# EAGLE design Dice_Simulator (EAGLE 9.6.2)
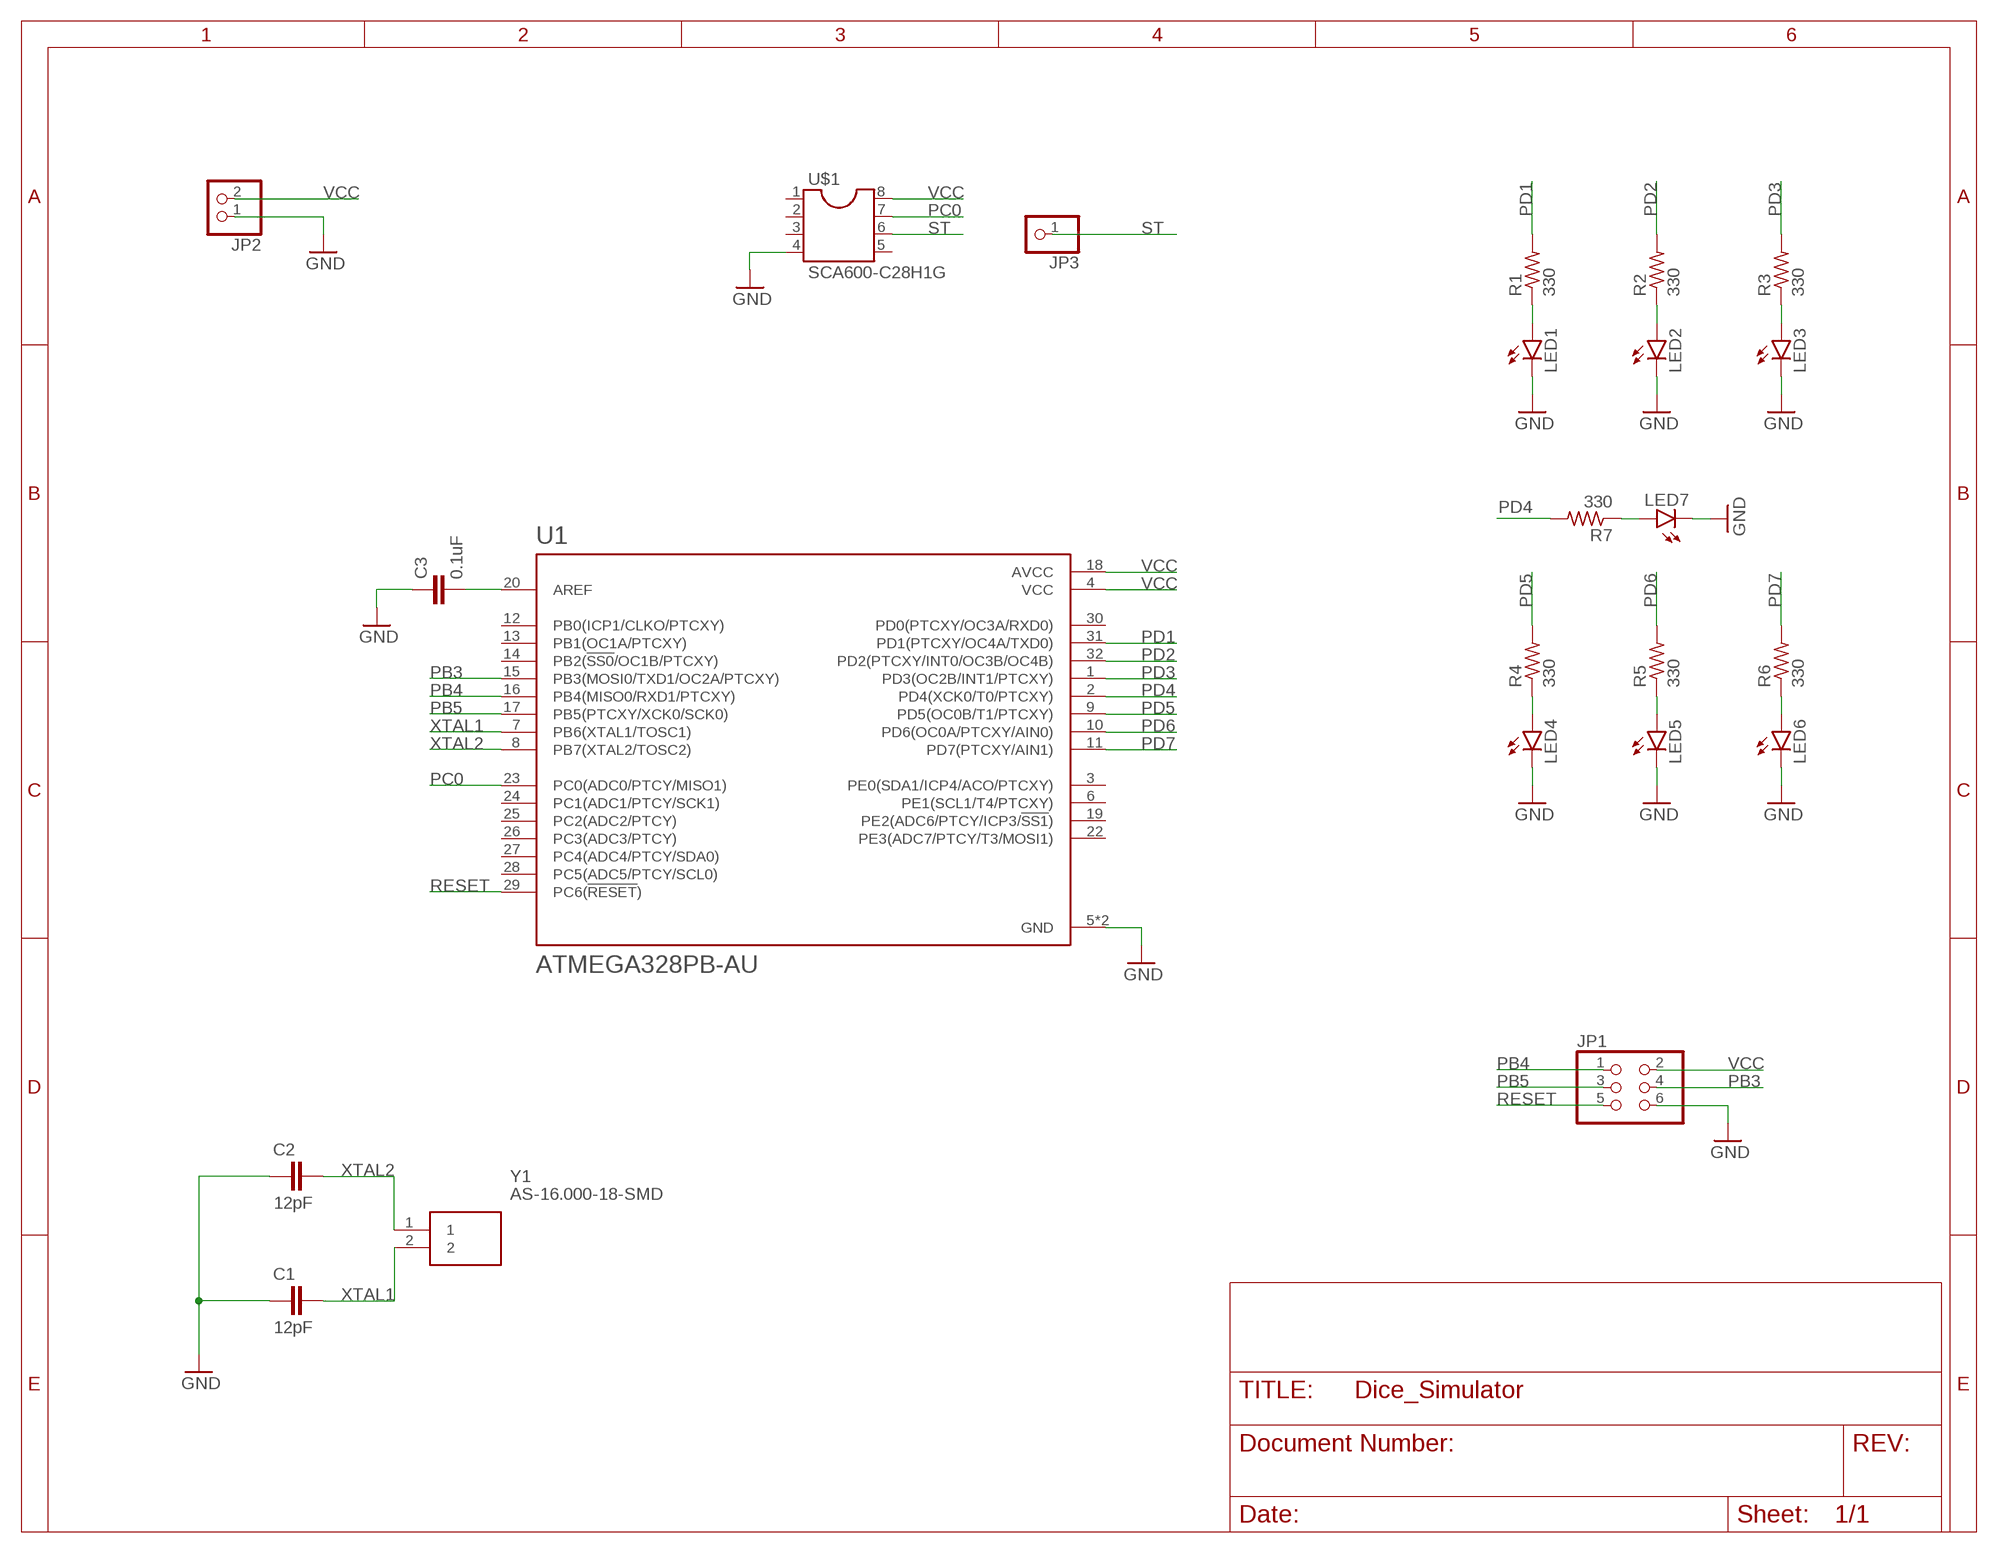
[diagram p0: schematic, sheet 1]

## Parts
C1  12pF  C-EUC0805  [C0805]
C2  12pF  C-EUC0805  [C0805]
C3  0.1uF  C-EUC0805  [C0805]
JP1  PINHD-2X3  [2X03]
JP2  PINHD-1X2  [1X02]
JP3  PINHD-1X1  [1X01]
LED1  LEDCHIPLED_0805  [CHIPLED_0805]
LED2  LEDCHIPLED_0805  [CHIPLED_0805]
LED3  LEDCHIPLED_0805  [CHIPLED_0805]
LED4  LEDCHIPLED_0805  [CHIPLED_0805]
LED5  LEDCHIPLED_0805  [CHIPLED_0805]
LED6  LEDCHIPLED_0805  [CHIPLED_0805]
LED7  LEDCHIPLED_0805  [CHIPLED_0805]
R1  330  R-US_M0805  [M0805]
R2  330  R-US_M0805  [M0805]
R3  330  R-US_M0805  [M0805]
R4  330  R-US_M0805  [M0805]
R5  330  R-US_M0805  [M0805]
R6  330  R-US_M0805  [M0805]
R7  330  R-US_M0805  [M0805]
U1  ATMEGA328PB-AU  [QFP80P900X900X120-32N]
U$1  SCA600-C28H1G  [SCA600-C28H1G]
Y1  AS-16.000-18-SMD  [HC-49]

## Nets
GND: C1.1 C2.1 C3.1 JP1.6 JP2.1 LED1.C LED2.C LED3.C LED4.C LED5.C LED6.C LED7.C U1.5(GND) U1.21(GND) U$1.4
N$1: LED1.A R1.1
N$2: LED2.A R2.1
N$3: LED3.A R3.1
N$4: LED4.A R4.1
N$5: LED5.A R5.1
N$6: LED6.A R6.1
N$7: LED7.A R7.1
N$8: C3.2 U1.20(AREF)
PB3: JP1.4 U1.15(PB3(MOSI0/TXD1/OC2A/PTCXY))
PB4: JP1.1 U1.16(PB4(MISO0/RXD1/PTCXY))
PB5: JP1.3 U1.17(PB5(PTCXY/XCK0/SCK0))
PC0: U1.23(PC0(ADC0/PTCY/MISO1)) U$1.7
PD1: R1.2 U1.31(PD1(PTCXY/OC4A/TXD0))
PD2: R2.2 U1.32(PD2(PTCXY/INT0/OC3B/OC4B))
PD3: R3.2 U1.1(PD3(OC2B/INT1/PTCXY))
PD4: R7.2 U1.2(PD4(XCK0/T0/PTCXY))
PD5: R4.2 U1.9(PD5(OC0B/T1/PTCXY))
PD6: R5.2 U1.10(PD6(OC0A/PTCXY/AIN0))
PD7: R6.2 U1.11(PD7(PTCXY/AIN1))
RESET: JP1.5 U1.29(PC6(!RESET!))
ST: JP3.1 U$1.6
VCC: JP1.2 JP2.2 U1.4(VCC) U1.18(AVCC) U$1.8
XTAL1: C1.2 U1.7(PB6(XTAL1/TOSC1)) Y1.2
XTAL2: C2.2 U1.8(PB7(XTAL2/TOSC2)) Y1.1
Unconnected: U1.3(PE0(SDA1/ICP4/ACO/PTCXY)) U1.6(PE1(SCL1/T4/PTCXY)) U1.12(PB0(ICP1/CLKO/PTCXY)) U1.13(PB1(OC1A/PTCXY)) U1.14(PB2(!SS0!/OC1B/PTCXY)) U1.19(PE2(ADC6/PTCY/ICP3/!SS1!)) U1.22(PE3(ADC7/PTCY/T3/MOSI1)) U1.24(PC1(ADC1/PTCY/SCK1)) U1.25(PC2(ADC2/PTCY)) U1.26(PC3(ADC3/PTCY)) U1.27(PC4(ADC4/PTCY/SDA0)) U1.28(PC5(ADC5/PTCY/SCL0)) U1.30(PD0(PTCXY/OC3A/RXD0)) U$1.1 U$1.2 U$1.3 U$1.5

## Library data of the parts
C1-C3 = rcl:C-EU: CAPACITOR, European symbol; SPICEPREFIX: C
JP1 = pinhead:PINHD-2X3: PIN HEADER
JP2 = pinhead:PINHD-1X2: PIN HEADER
JP3 = pinhead:PINHD-1X1: PIN HEADER
LED1-LED7 = led:LED: LED OSRAM: - CHIPLED LG R971, LG N971, LY N971, LG Q971, LY Q971, LO R971, LY R971 LH N974, LH R974 LS Q976, LO Q976, LY Q976 LO Q996 - Hyper CHIPLED LW Q18S LB Q993, LB Q99A, LB R99A - SideLED LS A670, LO A670, LY A670, LG A670, LP A670 LB A673, LV A673, LT A673, LW A673 LH A674 LY A675 LS A676, LA A676, LO A676, LY A676, LW A676 LS A679, LY A679, LG A679 - Hyper Micro SIDELED® LS Y876, LA Y876, LO Y876, LY Y876 LT Y87S - SmartLED LW L88C, LW L88S LB L89C, LB L89S, LG L890 LS L89K, LO L89K, LY L89K LS L896, LA L896, LO L896, LY L896 - TOPLED LS T670, LO T670, LY T670, LG T670, LP T670 LSG T670, LSP T670, LSY T670, LOP T670, LYG T670 LG T671, LOG T671, LSG T671 LB T673, LV T673, LT T673, LW T673 LH T674 LS T676, LA T676, LO T676, LY T676, LB T676, LH T676, LSB T676, LW T676 LB T67C, LV T67C, LT T67C, LS T67K, LO T67K, LY T67K, LW E67C LS E67B, LA E67B, LO E67B, LY E67B, LB E67C, LV E67C, LT E67C LW T67C LS T679, LY T679, LG T679 LS T770, LO T770, LY T770, LG T770, LP T770 LB T773, LV T773, LT T773, LW T773 LH T774 LS E675, LA E675, LY E675, LS T675 LS T776, LA T776, LO T776, LY T776, LB T776 LHGB T686 LT T68C, LB T68C - Hyper Mini TOPLED® LB M676 - Mini TOPLED Santana® LG M470 LS M47K, LO M47K, LY M47K Source: http://www.osram.convergy.de LUXEON: - LUMILED® LXK2-PW12-R00, LXK2-PW12-S00, LXK2-PW14-U00, LXK2-PW14-V00 LXK2-PM12-R00, LXK2-PM12-S00, LXK2-PM14-U00 LXK2-PE12-Q00, LXK2-PE12-R00, LXK2-PE12-S00, LXK2-PE14-T00, LXK2-PE14-U00 LXK2-PB12-K00, LXK2-PB12-L00, LXK2-PB12-M00, LXK2-PB14-N00, LXK2-PB14-P00, LXK2-PB14-Q00 LXK2-PR12-L00, LXK2-PR12-M00, LXK2-PR14-Q00, LXK2-PR14-R00 LXK2-PD12-Q00, LXK2-PD12-R00, LXK2-PD12-S00 LXK2-PH12-R00, LXK2-PH12-S00 LXK2-PL12-P00, LXK2-PL12-Q00, LXK2-PL12-R00 Source: www.luxeon.com KINGBRIGHT: KA-3528ASYC Source: www.kingbright.com
R1-R7 = rcl:R-US_: RESISTOR, American symbol; SPICEPREFIX: R
U1 = ATMEGA328PB-AU:ATMEGA328PB-AU: ATmega Series 20 MHz 32 KB Flash 2 KB SRAM 8-Bit Microcontroller - TQFP-32 Check prices <https://pricing.snapeda.com/parts/ATMEGA328PB-AU/Microchip%20Technology%20/%20Atmel/view-part?ref=eda>; AVAILABILITY: Good; DESCRIPTION: 8-bit Microcontrollers - MCU ATMEGA328PB 20MHZ IND TEMP; MF: Microchip Technology / Atmel; MP: ATMEGA328PB-AU; PACKAGE: TQFP-32 Microchip Technology / Atmel; PRICE: None; PURCHASE-URL: https://pricing.snapeda.com/search/part/ATMEGA328PB-AU/?ref=eda
U$1 = SCA600-C28H1G:SCA600-C28H1G
Y1 = SamacSys_Parts:AS-16.000-18-SMD: Crystal SMD 16.000MHz HC49S-SMD Crystal 16MHz, +/-30ppm, 2-Pin HC-49-US SMD Source: Datasheet <http://uk.rs-online.com/web/p/products/7037129P>; ALLIED_NUMBER: 70417567; DESCRIPTION: Crystal SMD 16.000MHz HC49S-SMD Crystal 16MHz, +/-30ppm, 2-Pin HC-49-US SMD; HEIGHT: mm; MANUFACTURER_NAME: RALTRON; MANUFACTURER_PART_NUMBER: AS-16.000-18-SMD; RS_PART_NUMBER: 7037129P; RS_PRICE-STOCK: http://uk.rs-online.com/web/p/products/7037129P

## Board
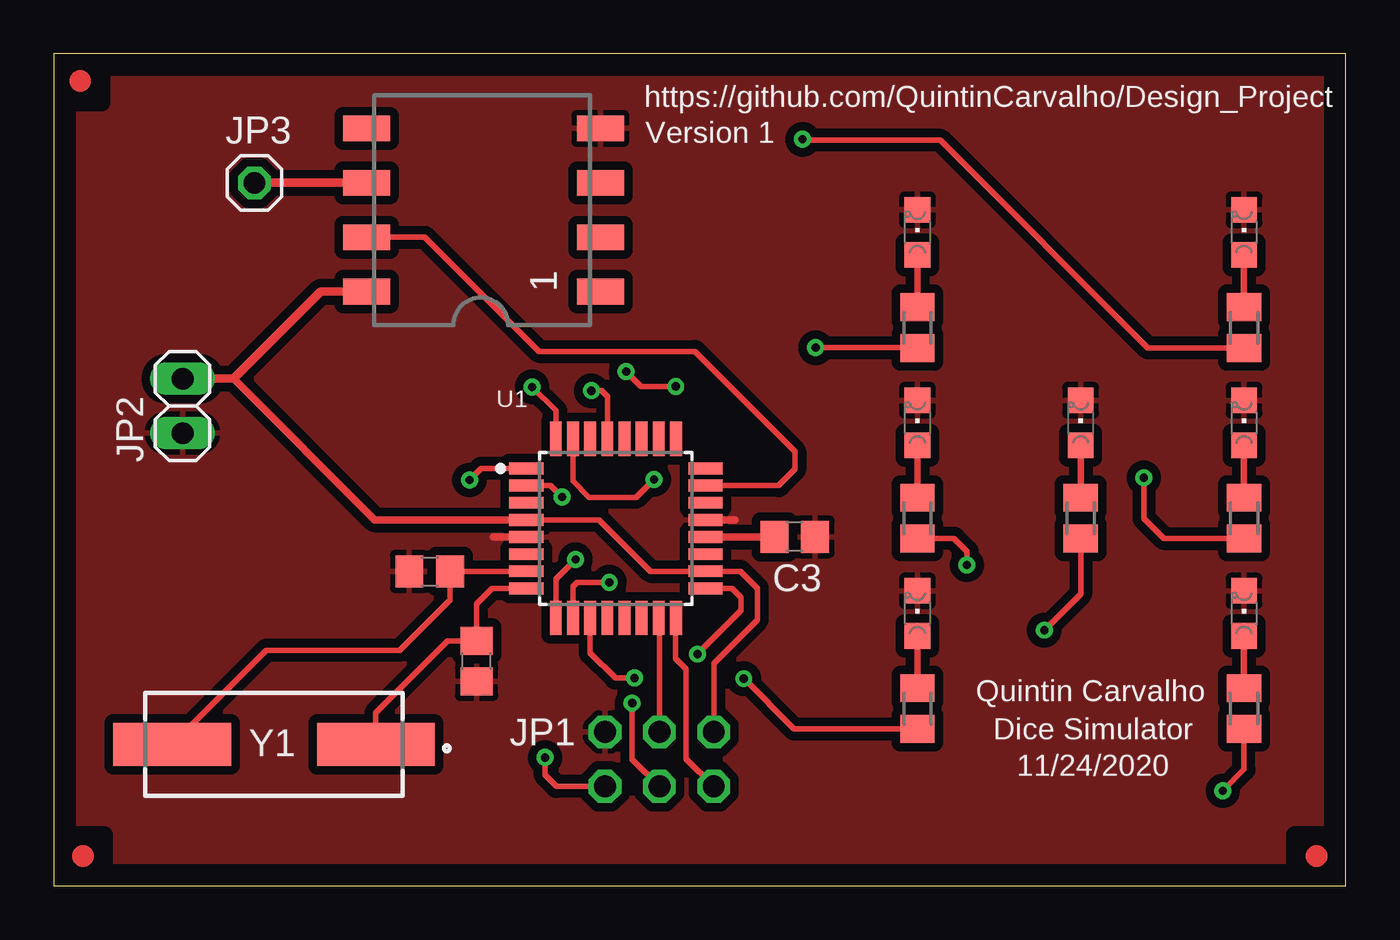
[diagram p1: board, top side]
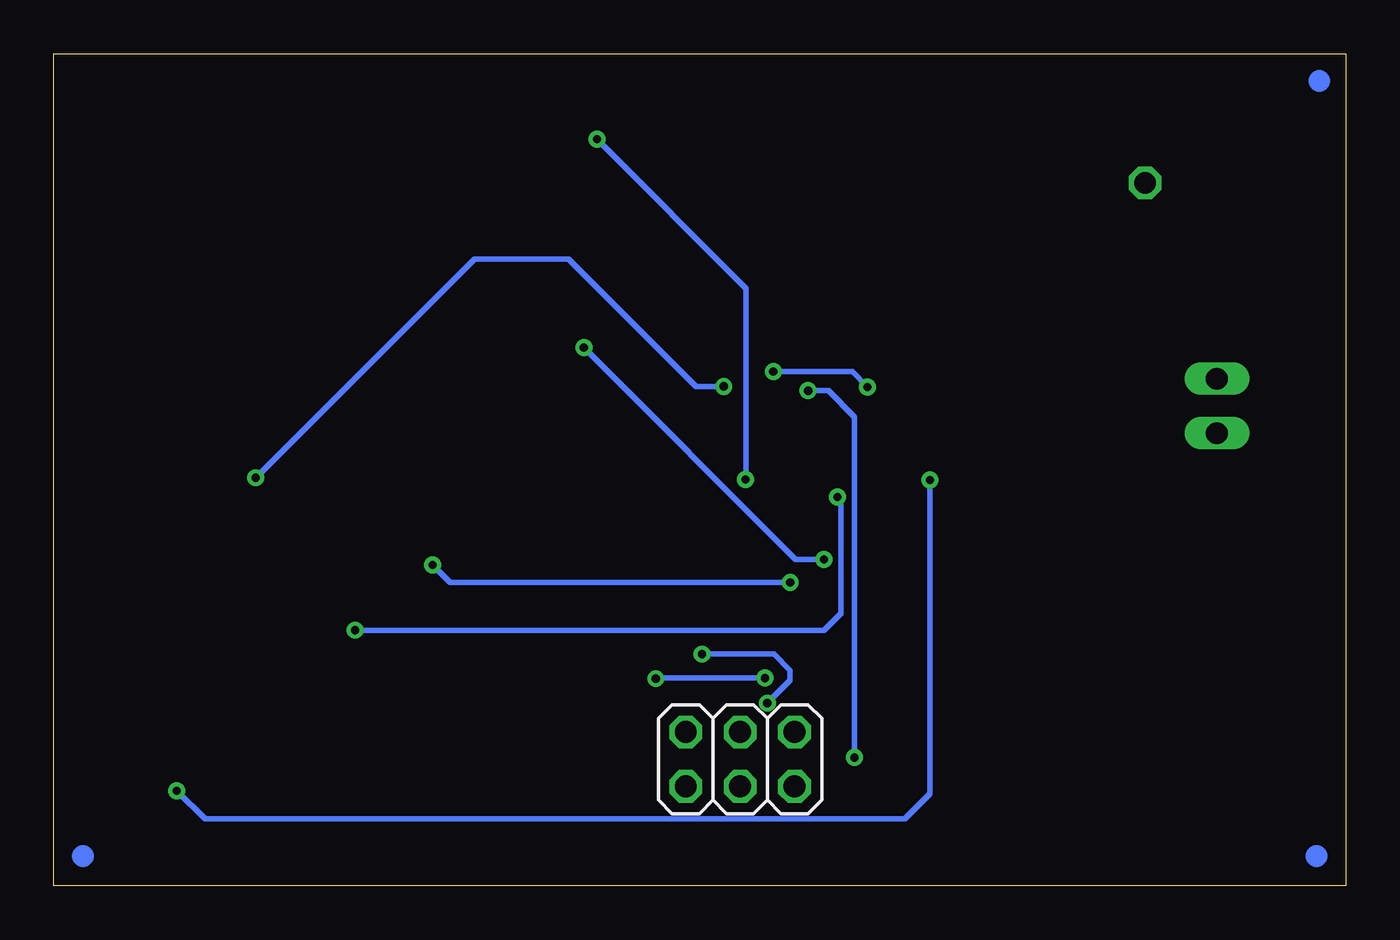
[diagram p2: board, bottom side, seen from below]

Size 60.3 x 38.85 mm. Coordinates in mm from the lower left corner, seen from the top.
Outline: 0,0 60.3,0 60.3,38.85 0,38.85 0,0
Copper layers (1*16): Top 0.035mm / dielectric 1.5mm / Bottom 0.035mm
Design rules "Design_Project": minimum track width 6mil, minimum drill 0.35mm, track to track 6mil, track to pad 6mil, pad to pad 6mil, via to via 6mil, smd to smd 6mil, copper to edge 40mil, drill to drill 6mil, minimum pad ring 10mil, minimum via ring 8mil, stop-mask expansion 4mil, vias tented up to drill 0mil, thermal gap 10mil

### Footprints (pad centres in the part's own frame; a part is rotated, then mirrored left to right if it is on the bottom)
C0805 = smd 1.3 x 1.5: 1 -0.95,0; 2 0.95,0
2X03 = drill 1.016 octagon: 1 -2.54,-1.27; 2 -2.54,1.27; 3 0,-1.27; 4 0,1.27; 5 2.54,-1.27; 6 2.54,1.27
1X02 = drill 1.016 long: 1 -1.27,0; 2 1.27,0
1X01 = drill 1.016 octagon: 1 0,0
CHIPLED_0805 = smd 1.2 x 1.2: A 0,-1.05; C 0,1.05
M0805 = smd 1.3 x 1.6: 1 -0.95,0; 2 0.95,0
QFP80P900X900X120-32N = smd 1.6 x 0.55: 1 -4.18,2.8; 2 -4.18,2; 3 -4.18,1.2; 4 -4.18,0.4; 5 -4.18,-0.4; 6 -4.18,-1.2; 7 -4.18,-2; 8 -4.18,-2.8; 17 4.18,-2.8; 18 4.18,-2; 19 4.18,-1.2; 20 4.18,-0.4; 21 4.18,0.4; 22 4.18,1.2; 23 4.18,2; 24 4.18,2.8 | smd 0.55 x 1.6: 9 -2.8,-4.18; 10 -2,-4.18; 11 -1.2,-4.18; 12 -0.4,-4.18; 13 0.4,-4.18; 14 1.2,-4.18; 15 2,-4.18; 16 2.8,-4.18; 25 2.8,4.18; 26 2,4.18; 27 1.2,4.18; 28 0.4,4.18; 29 -0.4,4.18; 30 -1.2,4.18; 31 -2,4.18; 32 -2.8,4.18
SCA600-C28H1G = smd 1.2 x 2.2: 1 -3.81,-7.102; 2 -1.27,-7.102; 3 1.27,-7.102; 4 3.81,-7.102; 5 3.81,3.8; 6 1.27,3.8; 7 -1.27,3.8; 8 -3.81,3.8
HC-49 = smd 5.5 x 2: 1 -4.75,0; 2 4.75,0

### Placement (x,y rotation side)
C1  17.55,14.68 0 top
C2  19.74,10.49 90 top
C3  34.58,16.29 180 top
JP1  28.27,5.92 0 bottom
JP2  6.02,22.4 90 top
JP3  9.37,32.82 0 top
LED1  55.55,30.51 0 top
LED2  55.55,21.62 0 top
LED3  55.55,12.73 0 top
LED4  40.31,30.51 0 top
LED5  40.31,21.62 0 top
LED6  40.31,12.73 0 top
LED7  47.93,21.62 0 top
R1  55.55,26.06 270 top
R2  55.55,17.17 270 top
R3  55.55,8.28 270 top
R4  40.31,26.06 270 top
R5  40.31,17.17 270 top
R6  40.31,8.28 270 top
R7  47.93,17.17 270 top
U1  26.24,16.69 0 top
U$1  18.41,31.55 90 top
U$2  [FID-ROUND-1MM]  1.24,37.57 0 top
U$3  [FID-ROUND-1MM]  1.37,1.4 0 top
U$4  [FID-ROUND-1MM]  58.93,1.4 0 top
Y1  10.29,6.6 180 top

### Tracks (layer width: path | path; a pad name or v marks a point on that pad's centre or on a via)
GND
  Top 0.356: U1.5 20.53,16.29 | U1.21 31.79,17.09
  pour Top (isolate 0.406): 0.64,38.23 0.64,0.64 59.69,0.64 59.69,38.23
N$1
  Top 0.305: LED1.A R1.1
N$2
  Top 0.305: LED2.A R2.1
N$3
  Top 0.305: LED3.A R3.1
N$4
  Top 0.305: LED4.A R4.1
N$5
  Top 0.305: LED5.A R5.1
N$6
  Top 0.305: LED6.A R6.1
N$7
  Top 0.305: LED7.A R7.1
N$8
  Top 0.356: U1.20 C3.2
PB3
  Top 0.254: JP1.4 28.27,12.48 U1.15
PB4
  Top 0.254: JP1.1 29.52,5.94 29.52,10.13 29.03,10.62 U1.16
PB5  (via drill 0.38)
  Top 0.254: JP1.3 27,5.92 v27,8.53 | v30.05,10.82 32.08,12.85 32.08,13.46 31.65,13.89 U1.17
  Bottom 0.254: v27,8.53 25.93,9.6 25.93,10.06 26.7,10.82 v30.05,10.82
PC0
  Top 0.254: U$1.7 17.32,30.28 22.66,24.94 29.92,24.94 34.59,20.27 34.59,19.46 33.83,18.69 U1.23
PD1  (via drill 0.38)
  Top 0.254: R1.2 51.06,25.11 41.38,34.8 35,34.8 v34.95,34.85 | v28.02,18.97 27.18,18.14 24.99,18.14 24.24,18.89 U1.31
  Bottom 0.254: v34.95,34.85 27.99,27.89 27.99,19 v28.02,18.97
PD2  (via drill 0.38)
  Top 0.254: U1.32 23.44,22.18 v22.33,23.29 | v26.72,24 27.41,23.32 v29.03,23.32 | v50.88,19.05 50.88,17.14 51.8,16.22 R2.2
  Bottom 0.254: v22.33,23.29 23.04,24 v26.72,24 | v29.03,23.32 30.33,23.32 36.27,29.26 40.66,29.26 v50.88,19.05
PD3  (via drill 0.38)
  Top 0.254: U1.1 19.95,19.49 v19.41,18.95 | v54.56,4.45 55.55,5.44 R3.2
  Bottom 0.254: v19.41,18.95 19.41,4.29 20.57,3.12 53.24,3.12 v54.56,4.45
PD4  (via drill 0.38)
  Top 0.254: R7.2 47.93,13.64 v46.23,11.94 | v23.72,18.16 23.2,18.69 U1.2
  Bottom 0.254: v46.23,11.94 24.36,11.94 23.57,12.72 23.57,17.75 23.72,17.91 v23.72,18.16
PD5  (via drill 0.38)
  Top 0.254: U1.9 23.44,14.32 v24.36,15.24 | v35.56,25.12 R4.2
  Bottom 0.254: v24.36,15.24 25.68,15.24 v35.56,25.12
PD6  (via drill 0.38)
  Top 0.254: U1.10 24.24,13.98 24.43,14.17 v25.93,14.17 | v42.62,14.99 42.62,15.62 42.02,16.22 R5.2
  Bottom 0.254: v25.93,14.17 41.81,14.17 v42.62,14.99
PD7  (via drill 0.38)
  Top 0.254: U1.11 25.04,10.88 26.21,9.7 v27.1,9.7 | v32.21,9.68 34.55,7.33 R6.2
  Bottom 0.254: v27.1,9.7 32.18,9.7 v32.21,9.68
RESET  (via drill 0.38)
  Top 0.254: JP1.5 23.47,4.65 22.94,5.18 v22.94,5.99 | v25.09,23.11 25.58,23.11 25.84,22.85 U1.29
  Bottom 0.254: v22.94,5.99 22.94,21.89 24.16,23.11 v25.09,23.11
ST
  Top 0.406: JP3.1 U$1.6
VCC
  Top 0.254: JP1.2 30.81,10.39 32.84,12.42 32.84,13.89 32.05,14.69 U1.18 27.86,14.68 25.46,17.09 U1.4
  Top 0.356: U1.4 14.99,17.09 8.41,23.67
  Top 0.406: JP2.2 8.41,23.67 12.47,27.74 U$1.8
XTAL1
  Top 0.254: U1.7 C1.2 18.5,13.35 16.15,11 9.93,11 Y1.2
XTAL2
  Top 0.254: U1.8 20.47,13.89 19.74,13.16 C2.2 19.73,11.43 18.39,11.43 15.04,8.08 Y1.1

### Text on the board
tNames: https://github.com/QuintinCarvalho/Design_Project | Version 1 | Quintin Carvalho | Dice Simulator | 11/24/2020